# Altium schematic sheet I2C_Keypad.SchDoc: STM32F446 CNC
size B; Author: AM; CompanyName: Expatria Technologies; DrawnBy: A.Marles; Engineer: AM; Organization: Expatria Technolgoies; Address1: PO Box 2084; Address3: Merritt, BC V1K 1B8; Address4: Canada; DocumentNumber: 6; SheetNumber: 6; SheetTotal: 26
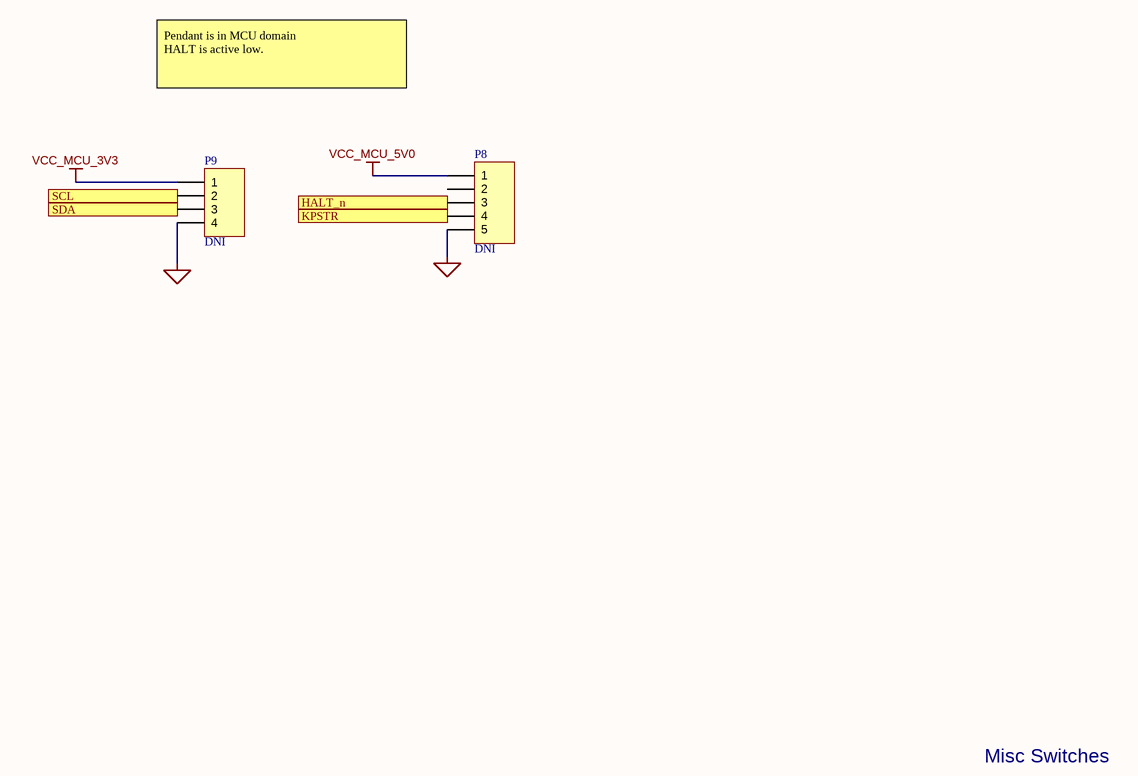
[diagram p0: I2C_Keypad.SchDoc]

## Parts
P8  DNI  [HDR1X5]
P9  DNI  [HDR1X4]

## Ports
HALT_n (out), KPSTR (out), SCL (in), SDA (in)

## Nets
MCU_GND: P8.5 P9.4
VCC_MCU_3V3: P9.1
VCC_MCU_5V0: P8.1
HALT_n: P8.3 ; port HALT_n
KPSTR: P8.4 ; port KPSTR
SCL: P9.2 ; port SCL
SDA: P9.3 ; port SDA

Not connected (* = marked no-connect by the designer): P8 2

## Notes on the sheet
- Pendant is in MCU domain
  HALT is active low.
- Misc Switches
- SHEET
- Expatria Technologies
- 625 Kane Valley Rd.
- Box 2084
- Merritt, BC V1K1B8
- PROJECT
- SIZE
- ENGR
- MODIFIED
- DOCUMENT
- REV
- Copyright Sienci Labs 2024. This document describes Open Hardware and is licensed under the CERN-OHL-S v2. No warranty is implied or expressed.
- EMAIL: INFO@EXPATRIA.CA
- B
- /

## Library data of the parts
P8 = Header 5: Header, 5-Pin; LatestRevisionDate: 17-Jul-2002; LatestRevisionNote: Re-released for DXP Platform.; Publisher: Altium Limited; SuppliersPartNumber: C124379; Supplier: LCSC
P9 = Header 4: Header, 4-Pin; Publisher: Altium Limited; SuppliersPartNumber: C124378; Supplier: LCSC